# EAGLE schematic interface (EAGLE 6.2)
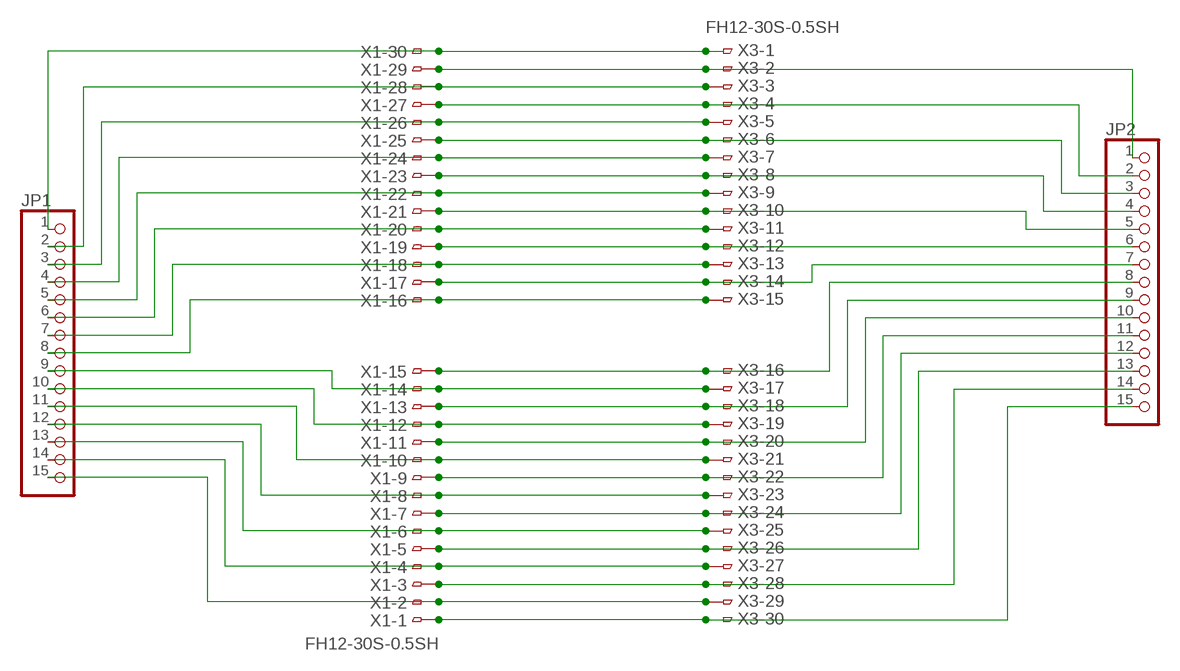
[diagram p0: schematic, sheet 1]

## Parts
JP1  PINHD-1X15  [1X15]
JP2  PINHD-1X15  [1X15]
X1  FH12-30S-0.5SH  [FH12-30S-0.5SH]
X3  FH12-30S-0.5SH  [FH12-30S-0.5SH]

## Nets
N$1: JP1.1 X1.30 X3.1
N$2: JP2.1 X1.29 X3.2
N$4: JP2.2 X1.27 X3.4
N$5: JP1.3 X1.26 X3.5
N$6: JP2.3 X1.25 X3.6
N$7: JP1.4 X1.24 X3.7
N$8: JP2.10 X1.11 X3.20
N$10: JP2.11 X1.9 X3.22
N$11: JP2.12 X1.7 X3.24
N$12: JP2.4 X1.23 X3.8
N$13: JP1.5 X1.22 X3.9
N$14: JP2.5 X1.21 X3.10
N$15: JP1.6 X1.20 X3.11
N$16: JP2.6 X1.19 X3.12
N$17: JP1.7 X1.18 X3.13
N$18: JP2.7 X1.17 X3.14
N$19: JP1.8 X1.16 X3.15
N$20: JP2.8 X1.15 X3.16
N$21: JP1.9 X1.14 X3.17
N$22: JP1.2 X1.28 X3.3
N$25: JP1.11 X1.10 X3.21
N$27: JP1.12 X1.8 X3.23
N$29: JP1.13 X1.6 X3.25
N$30: JP2.13 X1.5 X3.26
N$31: JP1.14 X1.4 X3.27
N$33: JP1.15 X1.2 X3.29
N$34: JP2.15 X1.1 X3.30
N$36: JP1.10 X1.12 X3.19
N$37: JP2.14 X1.3 X3.28
N$38: JP2.9 X1.13 X3.18

## Library data of the parts
JP1 JP2 = pinhead:PINHD-1X15: PIN HEADER
X1 X3 = con-hirose:FH12-30S-0.5S: 0.5mm Pitch Connectors For FPC/FFC Source: Data sheet <http://www.hirose.co.jp/cataloge_hp/e58605370.pdf>; MPN: FH12-30S-0.5SH(55); OC_FARNELL: 1324555; OC_NEWARK: 34M6176